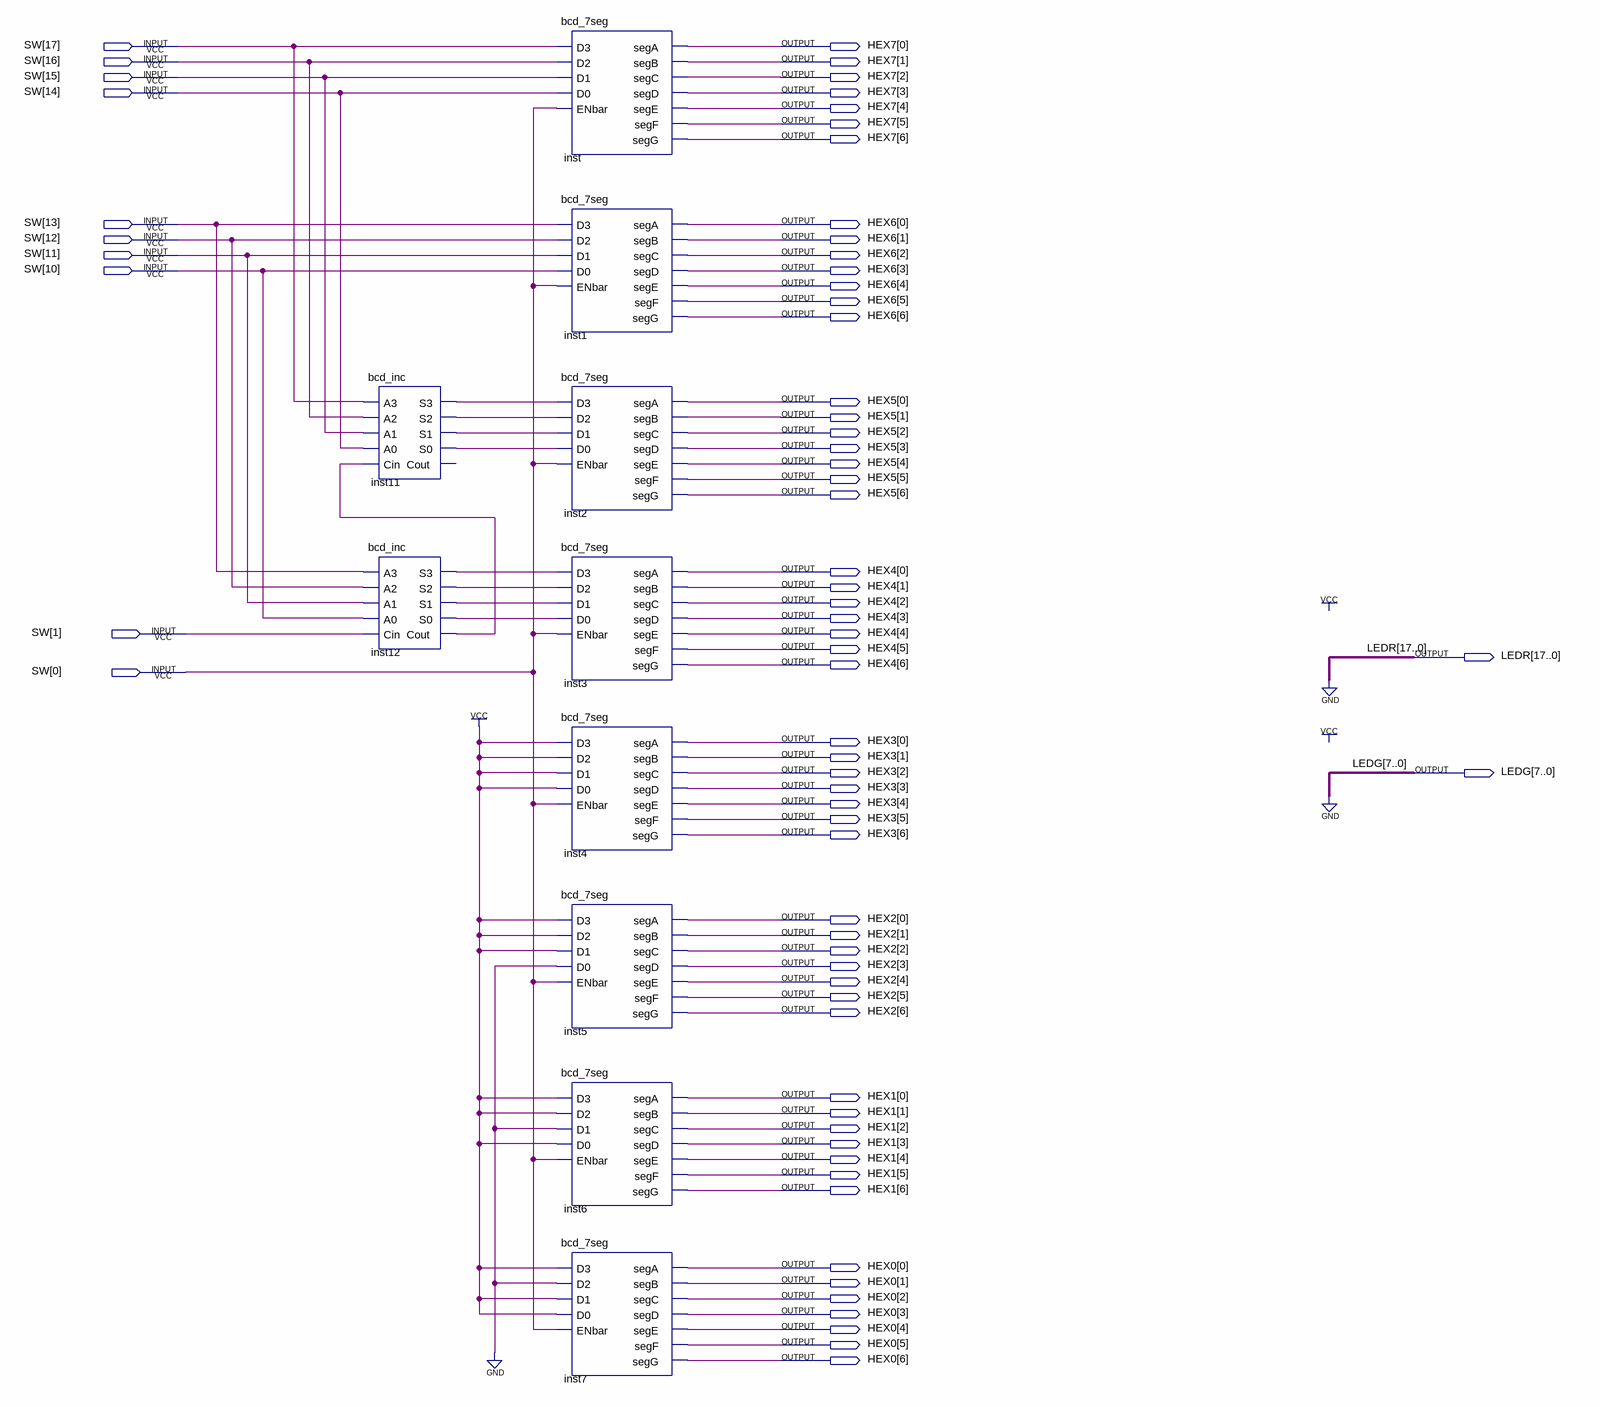
[diagram p0: schematic sheet]
// Quartus schematic Lab3_top_level.bdf as structural Verilog: 10 symbols, 68 pins
module Lab3_top_level (
  input  [17:0] SW,
  output [6:0] HEX7,
  output [6:0] HEX6,
  output [6:0] HEX5,
  output [6:0] HEX4,
  output [17:0] LEDR,
  output [6:0] HEX3,
  output [7:0] LEDG,
  output [6:0] HEX2,
  output [6:0] HEX1,
  output [6:0] HEX0
);

  wire inst11_s0, inst11_s1, inst11_s2, inst11_s3, inst12_cout, inst12_s0, inst12_s1, inst12_s2, inst12_s3;

  bcd_inc inst11 (
    .A3(SW[17]), .A2(SW[16]), .A1(SW[15]), .A0(SW[14]), .Cin(inst12_cout), .S3(inst11_s3), .S2(inst11_s2),
    .S1(inst11_s1), .S0(inst11_s0));  // open: Cout
  bcd_inc inst12 (
    .A3(SW[13]), .A2(SW[12]), .A1(SW[11]), .A0(SW[10]), .Cin(SW[1]), .S3(inst12_s3), .S2(inst12_s2),
    .S1(inst12_s1), .S0(inst12_s0), .Cout(inst12_cout));
  bcd_7seg inst (
    .D3(SW[17]), .D2(SW[16]), .D1(SW[15]), .D0(SW[14]), .ENbar(SW[0]), .segA(HEX7[0]), .segB(HEX7[1]),
    .segC(HEX7[2]), .segD(HEX7[3]), .segE(HEX7[4]), .segF(HEX7[5]), .segG(HEX7[6]));
  bcd_7seg inst1 (
    .D3(SW[13]), .D2(SW[12]), .D1(SW[11]), .D0(SW[10]), .ENbar(SW[0]), .segA(HEX6[0]), .segB(HEX6[1]),
    .segC(HEX6[2]), .segD(HEX6[3]), .segE(HEX6[4]), .segF(HEX6[5]), .segG(HEX6[6]));
  bcd_7seg inst2 (
    .D3(inst11_s3), .D2(inst11_s2), .D1(inst11_s1), .D0(inst11_s0), .ENbar(SW[0]), .segA(HEX5[0]),
    .segB(HEX5[1]), .segC(HEX5[2]), .segD(HEX5[3]), .segE(HEX5[4]), .segF(HEX5[5]), .segG(HEX5[6]));
  bcd_7seg inst3 (
    .D3(inst12_s3), .D2(inst12_s2), .D1(inst12_s1), .D0(inst12_s0), .ENbar(SW[0]), .segA(HEX4[0]),
    .segB(HEX4[1]), .segC(HEX4[2]), .segD(HEX4[3]), .segE(HEX4[4]), .segF(HEX4[5]), .segG(HEX4[6]));
  bcd_7seg inst4 (
    .D3(1'b1), .D2(1'b1), .D1(1'b1), .D0(1'b1), .ENbar(SW[0]), .segA(HEX3[0]), .segB(HEX3[1]),
    .segC(HEX3[2]), .segD(HEX3[3]), .segE(HEX3[4]), .segF(HEX3[5]), .segG(HEX3[6]));
  bcd_7seg inst5 (
    .D3(1'b1), .D2(1'b1), .D1(1'b1), .D0(1'b0), .ENbar(SW[0]), .segA(HEX2[0]), .segB(HEX2[1]),
    .segC(HEX2[2]), .segD(HEX2[3]), .segE(HEX2[4]), .segF(HEX2[5]), .segG(HEX2[6]));
  bcd_7seg inst6 (
    .D3(1'b1), .D2(1'b1), .D1(1'b0), .D0(1'b1), .ENbar(SW[0]), .segA(HEX1[0]), .segB(HEX1[1]),
    .segC(HEX1[2]), .segD(HEX1[3]), .segE(HEX1[4]), .segF(HEX1[5]), .segG(HEX1[6]));
  bcd_7seg inst7 (
    .D3(1'b1), .D2(1'b0), .D1(1'b1), .D0(1'b1), .ENbar(SW[0]), .segA(HEX0[0]), .segB(HEX0[1]),
    .segC(HEX0[2]), .segD(HEX0[3]), .segE(HEX0[4]), .segF(HEX0[5]), .segG(HEX0[6]));

  assign LEDG = {8{1'b0}};
  assign LEDR = {18{1'b0}};
endmodule
